# EAGLE design CAN_Adapter_ES_PCB (EAGLE 9.6.2)
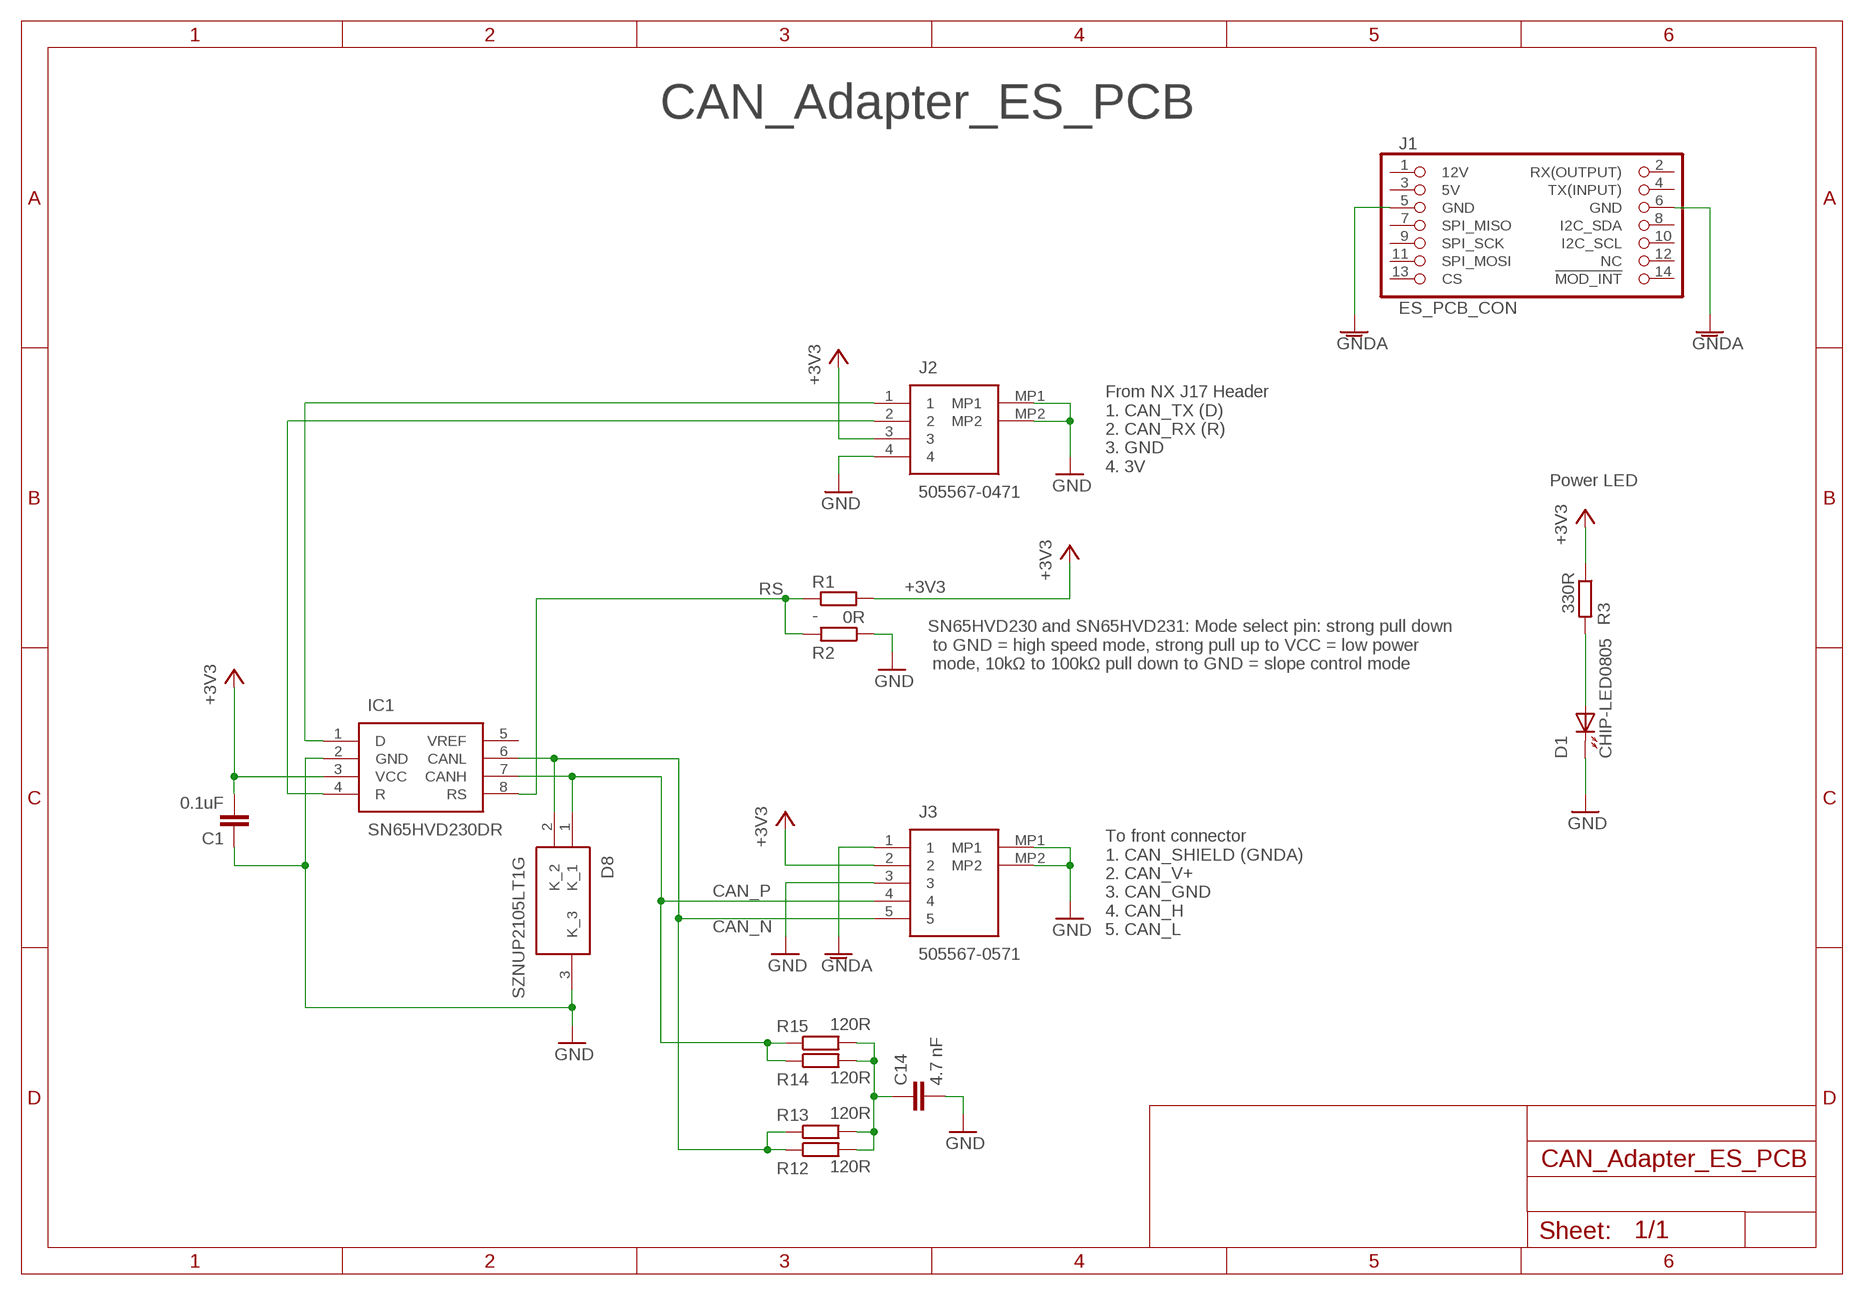
[diagram p0: schematic, sheet 1]

## Parts
C1  0.1uF  C0603  [C0603]
C14  4.7 nF  C0805  [C0805]
D1  CHIP-LED0805  [CHIP-LED0805]
D8  SZNUP2105LT1G  [SOT96P237X111-3N]
IC1  SN65HVD230DR  [SOT127P600X175-8N]
J1  ES_PCB_CON  [ES_PCB_CON]
J2  505567-0471  [5055680471]
J3  505567-0571  [5055680571]
R1  -  R0603  [R0603]
R2  0R  R0603  [R0603]
R3  330R  R0603  [R0603]
R12  120R  R-EU_R1210  [R1210]
R13  120R  R-EU_R1210  [R1210]
R14  120R  R-EU_R1210  [R1210]
R15  120R  R-EU_R1210  [R1210]

## Nets
+3V3: C1.2 IC1.3(VCC) J2.3 J3.2 R1.2 R3.1
CAN_N: D8.2(K_2) IC1.6(CANL) J3.5 R12.1 R13.1
CAN_P: D8.1(K_1) IC1.7(CANH) J3.4 R14.1 R15.1
D: IC1.1(D) J2.1
GND: C1.1 C14.2 D1.C(K) D8.3(K_3) IC1.2(GND) J2.4 J2.MP1 J2.MP2 J3.3 J3.MP1 J3.MP2 R2.1
GNDA: J1.5(GND) J1.6(GND) J3.1
N$1: D1.A R3.2
N$2: C14.1 R12.2 R13.2 R14.2 R15.2
R: IC1.4(R) J2.2
RS: IC1.8(RS) R1.1 R2.2
Unconnected: IC1.5(VREF) J1.1(12V) J1.2(RX(OUTPUT)) J1.3(5V) J1.4(TX(INPUT)) J1.7(SPI_MISO) J1.8(I2C_SDA) J1.9(SPI_SCK) J1.10(I2C_SCL) J1.11(SPI_MOSI) J1.12(NC) J1.13(CS) J1.14(!MOD_INT)

## Notes on the sheet
- CAN_Adapter_ES_PCB
- From NX J17 Header
  1. CAN_TX (D)
  2. CAN_RX (R)
  3. GND
  4. 3V
- Power LED
- SN65HVD230 and SN65HVD231: Mode select pin: strong pull down
   to GND = high speed mode, strong pull up to VCC = low power
   mode, 10kΩ to 100kΩ pull down to GND = slope control mode
- To front connector
  1. CAN_SHIELD (GNDA)
  2. CAN_V+
  3. CAN_GND
  4. CAN_H
  5. CAN_L

## Library data of the parts
C1 = CASE-RCL:C0603: Standard Chip CAPACITOR 0605 (1608 Metric) Description: Standard Chip CAPACITOR 0605 (1608 Metric)
C14 = CASE-RCL:C0805: Standard Chip CAPACITOR 0805 (2012 Metric) Description: Standard Chip CAPACITOR 0805 (2012 Metric)
D1 = CASE-LED:CHIP-LED0805: CHIP-LED0805 (SMD) Description: Standard 0805 SMD CHIP-LED
D8 = RescueRunner:SZNUP2105LT1G: Dual Bi-Directional TVS Diode, 350W peak, 3-pin SOT-23 Source: Datasheet <https://componentsearchengine.com/Datasheets/1/SZNUP2105LT1G.pdf>; DESCRIPTION: Dual Bi-Directional TVS Diode, 350W peak, 3-pin SOT-23; HEIGHT: 1.11mm; MANUFACTURER_NAME: ON Semiconductor; MANUFACTURER_PART_NUMBER: SZNUP2105LT1G; MOUSER_PART_NUMBER: 863-SZNUP2105LT1G; MOUSER_PRICE-STOCK: https://www.mouser.com/Search/Refine.aspx?Keyword=863-SZNUP2105LT1G
IC1 = RescueRunner:SN65HVD230DR: 3.3 V CAN Transceiver with Standby Mode Source: Datasheet <http://www.ti.com/lit/gpn/sn65hvd230>; DESCRIPTION: 3.3 V CAN Transceiver with Standby Mode; HEIGHT: 1.75mm; MANUFACTURER_NAME: Texas Instruments; MANUFACTURER_PART_NUMBER: SN65HVD230DR; MOUSER_PART_NUMBER: 595-SN65HVD230DR; MOUSER_PRICE-STOCK: https://www.mouser.com/Search/Refine.aspx?Keyword=595-SN65HVD230DR
J1 = Unicorn_ACU_LIB:ES_PCB_CON
J2 = Unicorn_ACU_LIB:505567-0471: Vertical
J3 = Unicorn_ACU_LIB:505567-0571: Vertical; ALLIED_NUMBER: 71085525; DESCRIPTION: Headers & Wire Housings MicroLockPlus 1.25MM VERT HDR SR 5CKT BLK; HEIGHT: 4.05mm; MANUFACTURER_NAME: Molex; MANUFACTURER_PART_NUMBER: 505568-0571; RS_PART_NUMBER: 1615926P; RS_PRICE-STOCK: http://uk.rs-online.com/web/p/products/1615926P
R1-R3 = CASE-RCL:R0603: Standard Chip RESISTOR 0603 (1608 Metric) Description: Standard Chip RESISTOR 0603 (1608 Metric)
R12-R15 = rcl:R-EU_: RESISTOR, European symbol; SPICEPREFIX: R

## Net classes
0 default: width 0.2 mm

## Board
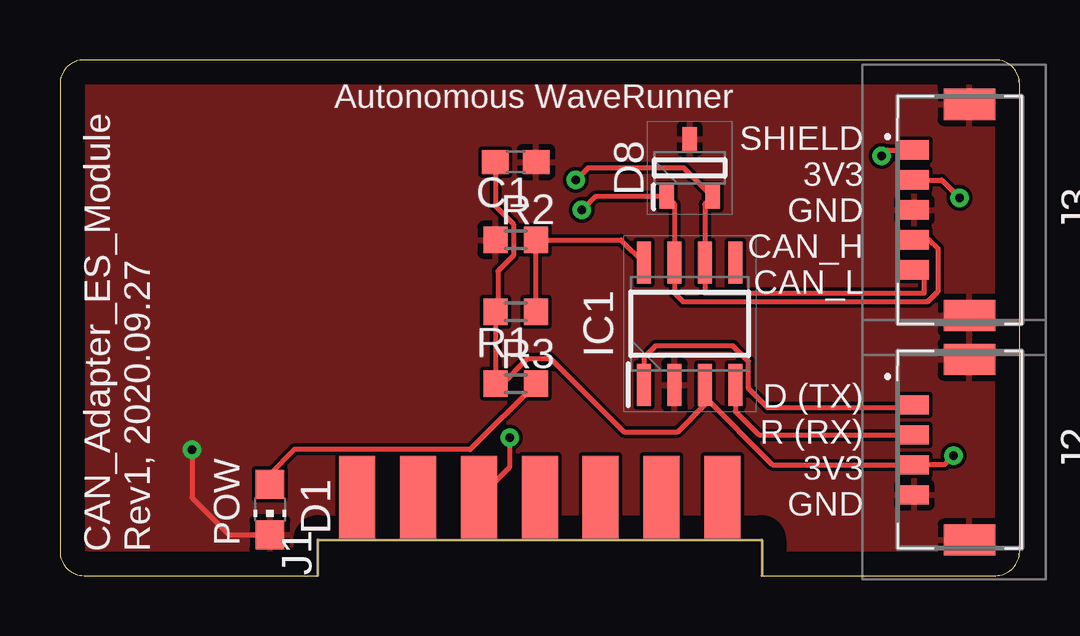
[diagram p1: board, top side]
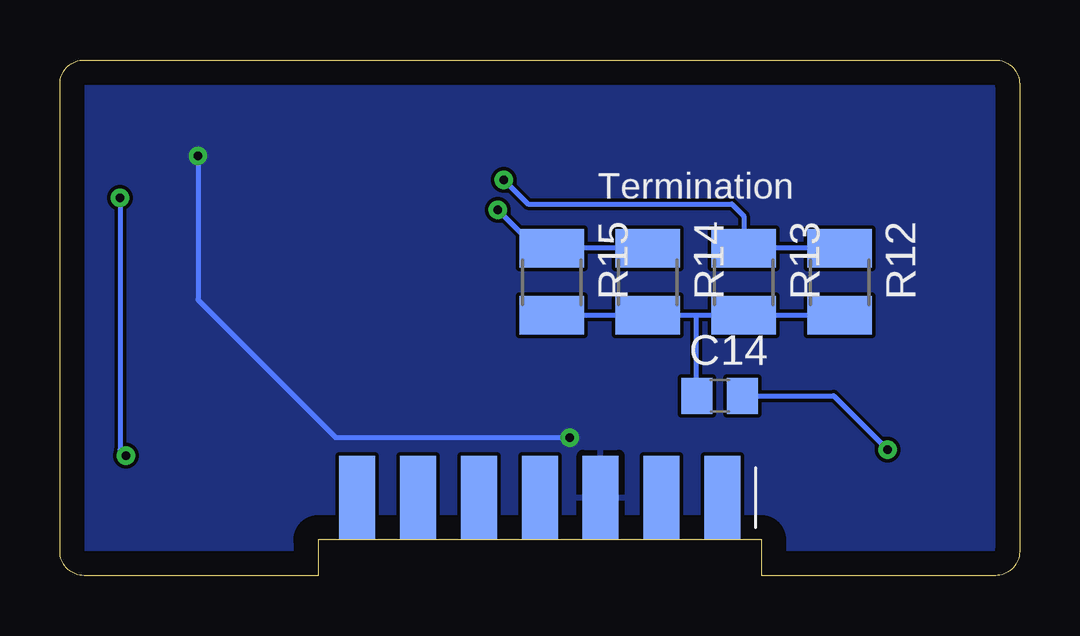
[diagram p2: board, bottom side, seen from below]

Size 40 x 21.5 mm. Coordinates in mm from the lower left corner, seen from the top.
Outline: 39,0 arc90 40,1 40,20.5 arc90 39,21.5 1,21.5 arc90 0,20.5 0,1 arc90 1,0 10.75,0 10.75,1.5 29.25,1.5 29.25,0 39,0
Copper layers (1*16): Top 0.035mm / dielectric 1.5mm / Bottom 0.035mm
Design rules "default": minimum track width 6mil, minimum drill 0.35mm, track to track 6mil, track to pad 6mil, pad to pad 6mil, via to via 6mil, smd to smd 6mil, copper to edge 40mil, drill to drill 6mil, minimum pad ring 10mil, minimum via ring 8mil, stop-mask expansion 4mil, vias tented up to drill 0mil, thermal gap 10mil

### Footprints (pad centres in the part's own frame; a part is rotated, then mirrored left to right if it is on the bottom)
C0603 = smd 1.1 x 1: 1 -0.85,0; 2 0.85,0
C0805 = smd 1.3 x 1.5: 1 -0.95,0; 2 0.95,0
CHIP-LED0805 = smd 1.2 x 1.2: A 0,-1.05; C 0,1.05
SOT96P237X111-3N = smd 1 x 0.6: 1 -1.2,0.955; 2 -1.2,-0.955; 3 1.2,0
SOT127P600X175-8N = smd 1.75 x 0.6: 1 -2.55,1.905; 2 -2.55,0.635; 3 -2.55,-0.635; 4 -2.55,-1.905; 5 2.55,-1.905; 6 2.55,-0.635; 7 2.55,0.635; 8 2.55,1.905
ES_PCB_CON = smd 1.5 x 3.5 bottom: 1 -7.62,1.75; 3 -5.08,1.75; 5 -2.54,1.75; 7 0,1.75; 9 2.54,1.75; 11 5.08,1.75; 13 7.62,1.75 | smd 1.5 x 3.5: 2 -7.62,1.75; 4 -5.08,1.75; 6 -2.54,1.75; 8 0,1.75; 10 2.54,1.75; 12 5.08,1.75; 14 7.62,1.75
5055680471 = smd 0.8 x 1.2: 1 -1.865,-1.882; 2 -0.615,-1.882; 3 0.635,-1.882; 4 1.885,-1.882 | smd 1.3 x 2.15: MP1 -3.765,0.412; MP2 3.765,0.412
5055680571 = smd 0.8 x 1.2: 1 -2.5,-1.882; 2 -1.25,-1.882; 3 0,-1.882; 4 1.25,-1.882; 5 2.5,-1.882 | smd 1.3 x 2.15: MP1 -4.4,0.412; MP2 4.4,0.412
R0603 = smd 1 x 1.1: 1 -0.85,0; 2 0.85,0
R1210 = smd 1.6 x 2.7: 1 -1.4,0; 2 1.4,0

### Placement (x,y rotation side)
C1  19,17.25 180 top
C14  12.5,7.5 0 bottom
D1  8.75,2.75 180 top
D8  26.25,17 90 top
IC1  26.25,10.5 90 top
J1  20,1.5 0 top
J2  37.5,5.25 270 top
J3  37.5,15.25 270 top
R1  19,11 180 top
R2  19,14 0 top
R3  19,8 0 top
R12  7.5,12.25 270 bottom
R13  11.5,12.25 270 bottom
R14  15.5,12.25 270 bottom
R15  19.5,12.25 270 bottom

### Tracks (layer width: path | path; a pad name or v marks a point on that pad's centre or on a via)
+3V3  (via drill 0.35)
  Top 0.2: C1.2 18.15,15.41 18.9,14.65 18.9,13.35 18.25,12.69 18.25,11.1 R1.2 R3.1 18.44,8 19.5,9.05 20.45,9.05 23.5,6 25.75,6 26.88,7.13 IC1.3 26.88,7.44 29.71,4.62 J2.3 36.86,4.62 v37.25,5 | J3.2 36.75,16.5 v37.5,15.75
  Bottom 0.2: v37.5,15.75 37.5,5.25 v37.25,5
CAN_N  (via drill 0.35)
  Top 0.2: J3.5 36.02,12.75 36.02,11.78 26.88,11.78 IC1.6 26.88,15.48 D8.2 26,17 22,17 v21.5,16.5
  Bottom 0.2: R12.1 R13.1 11.5,15 12,15.5 20.5,15.5 v21.5,16.5
CAN_P  (via drill 0.35)
  Top 0.2: J3.4 36.25,14 36.6,13.65 36.6,11.85 36.17,11.42 25.97,11.42 25.62,11.78 IC1.7 25.62,15.48 D8.1 22.3,15.8 v21.75,15.25
  Bottom 0.2: R14.1 R15.1 20.15,13.65 v21.75,15.25
D
  Top 0.2: J2.1 35.5,7 29.5,7 28.71,7.79 28.71,8.93 28.06,9.58 24.83,9.58 24.34,9.1 IC1.1
GND  (via drill 0.35)
  Top 0.2: v5.5,5.25 5.5,3.25 7.05,1.7 D1.C
  Bottom 0.2: C14.2 7.75,7.5 v5.5,5.25
  pour Top: -0.5,22 41,22 41.75,21.25 42.25,20.75 42.25,-1 -0.25,-1 -0.75,-0.5 -0.75,-0.25 -0.75,21.75
GNDA  (via drill 0.35)
  Top 0.2: J1.6 18.75,4.54 v18.75,5.75 | v34.25,17.5 34.5,17.75 J3.1
  Bottom 0.2: v18.75,5.75 28.5,5.75 34.25,11.5 v34.25,17.5
  pour Bottom: -0.75,21.75 -0.5,22 41,22 42.25,20.75 42.25,-1 -0.25,-1 -0.75,-0.5
N$1
  Top 0.2: R3.2 17.1,5.25 9.75,5.25 8.75,4.25 D1.A
N$2
  Bottom 0.2: R12.2 R13.2 13.5,10.85 | 13.5,10.85 R14.2 R15.2 | 13.5,10.85 13.5,7.55 C14.1
R
  Top 0.2: J2.2 29.13,5.87 28.16,6.84 IC1.4
RS
  Top 0.2: IC1.8 23.39,14 R2.2 R1.1

### Text on the board
tPlace: Autonomous WaveRunner | SHIELD / 3V3 / GND / CAN_H / CAN_L | D (TX) / R (RX) / 3V3 / GND | CAN_Adapter_ES_Module / Rev1, 2020.09.27 | POW
bPlace: Termination